# EAGLE design hovercraft (brian-pc's conflicted copy 2016-11-01) (EAGLE 6.6.0)
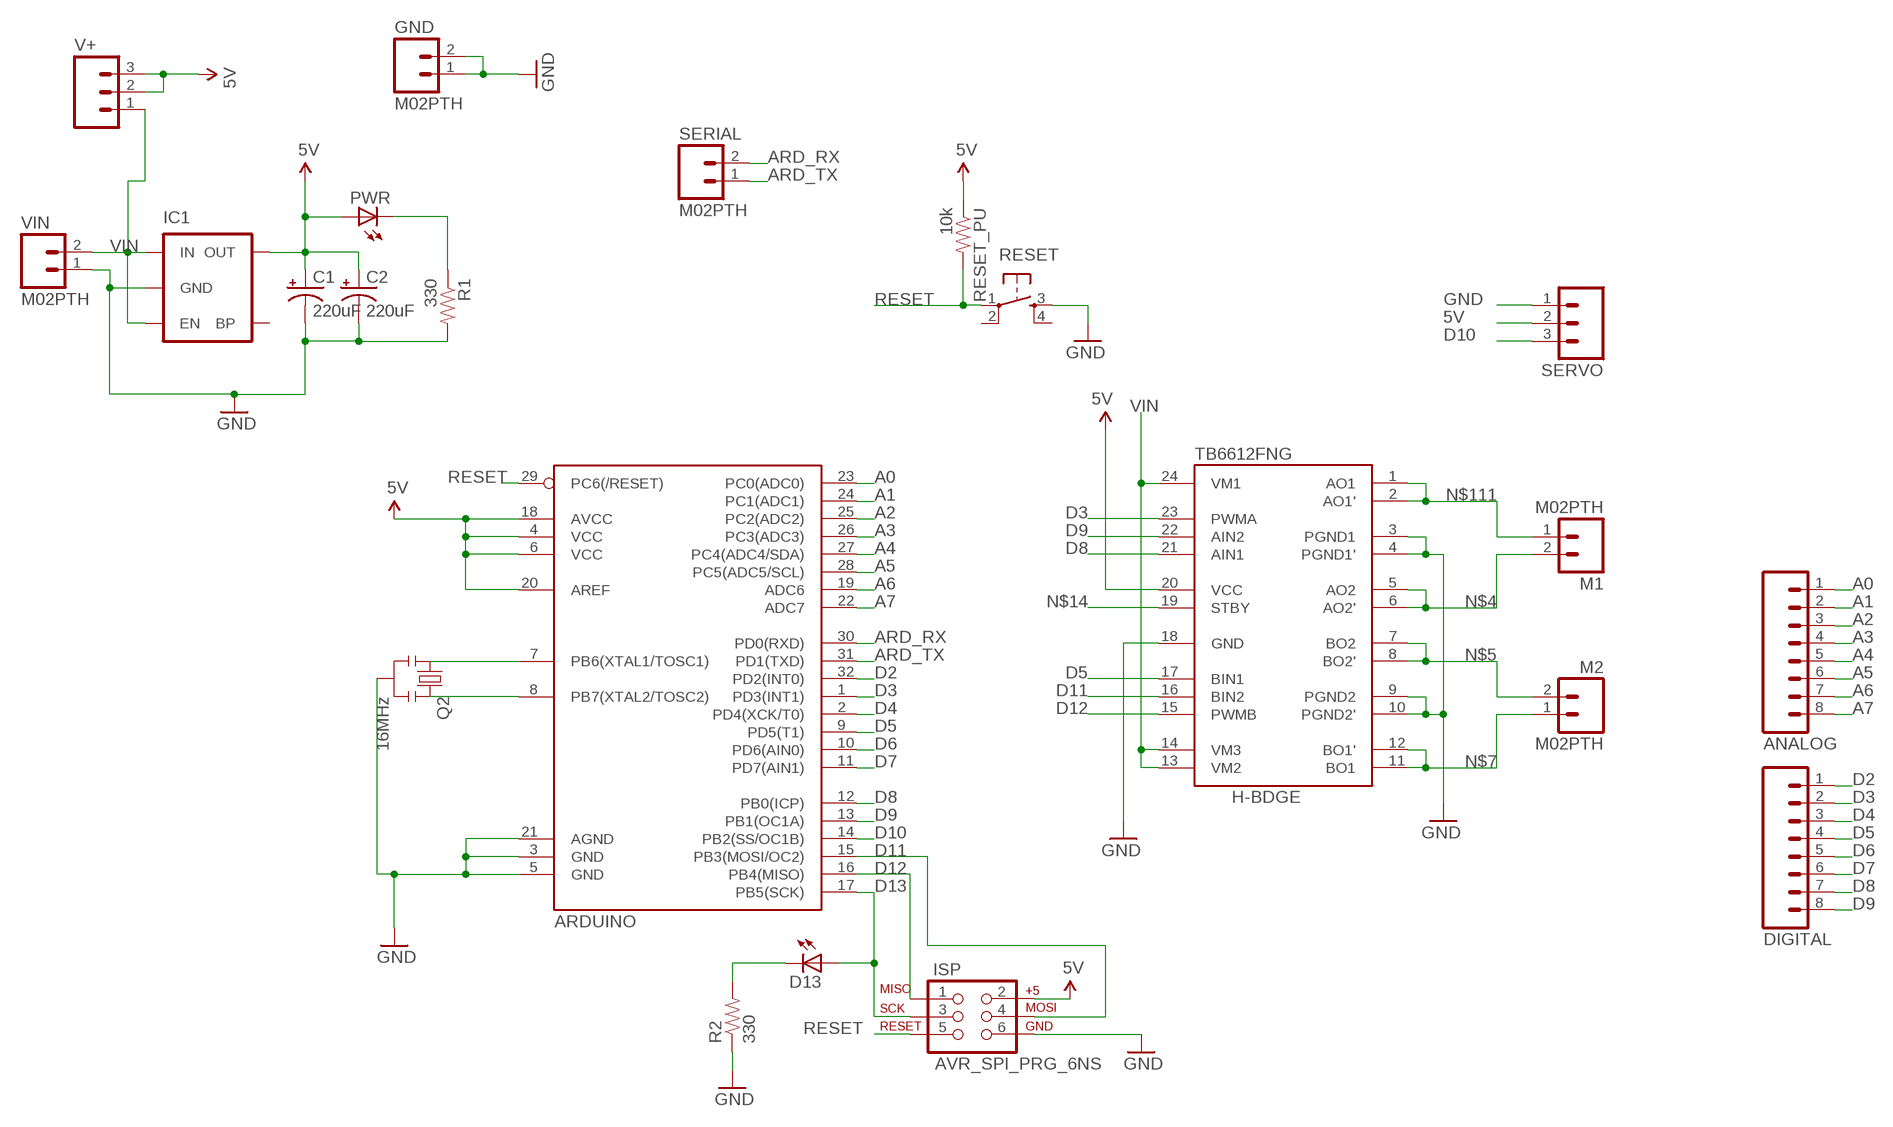
[diagram p0: schematic, sheet 1]

## Parts
ANALOG  M08LOCK  [1X08_LOCK]
ARDUINO  ATMEGA328_SMT  [TQFP32-08]
C1  220uF  CAP_POLPTH1  [CPOL-RADIAL-100UF-25V]
C2  220uF  CAP_POLPTH1  [CPOL-RADIAL-100UF-25V]
D13  LEDCHIPLED_0805  [CHIPLED_0805]
DIGITAL  M08LOCK  [1X08_LOCK]
GND  M02PTH  [1X02]
H-BDGE  TB6612FNG  [SSOP24]
IC1  MIC52055V  [SOT23-5]
ISP  AVR_SPI_PRG_6NS  [2X3-NS]
M1  M02PTH  [1X02]
M2  M02PTH  [1X02]
PWR  LEDCHIPLED_0805  [CHIPLED_0805]
Q2  16MHz  RESONATOR16MHZ  [RESONATOR-SMD]
R1  330  RESISTOR0805-RES  [0805]
R2  330  RESISTOR0805-RES  [0805]
RESET  TAC_SWITCHSMD  [TACTILE_SWITCH_SMD]
RESET_PU  10k  RESISTOR0805-RES  [0805]
SERIAL  M02PTH  [1X02]
SERVO  M03PTH  [1X03]
V+  M03PTH  [1X03]
VIN  M02PTH  [1X02]

## Nets
5V: ARDUINO.4(VCC) ARDUINO.6(VCC) ARDUINO.18(AVCC) ARDUINO.20(AREF) C1.1(+) C2.1(+) H-BDGE.20(VCC) IC1.5(OUT) ISP.2 PWR.A RESET_PU.1 SERVO.2 V+.2 V+.3
A0: ANALOG.1 ARDUINO.23(PC0(ADC0))
A1: ANALOG.2 ARDUINO.24(PC1(ADC1))
A2: ANALOG.3 ARDUINO.25(PC2(ADC2))
A3: ANALOG.4 ARDUINO.26(PC3(ADC3))
A4: ANALOG.5 ARDUINO.27(PC4(ADC4/SDA))
A5: ANALOG.6 ARDUINO.28(PC5(ADC5/SCL))
A6: ANALOG.7 ARDUINO.19(ADC6)
A7: ANALOG.8 ARDUINO.22(ADC7)
ARD_RX: ARDUINO.30(PD0(RXD)) SERIAL.2
ARD_TX: ARDUINO.31(PD1(TXD)) SERIAL.1
D2: ARDUINO.32(PD2(INT0)) DIGITAL.1
D3: ARDUINO.1(PD3(INT1)) DIGITAL.2 H-BDGE.23(PWMA)
D4: ARDUINO.2(PD4(XCK/T0)) DIGITAL.3
D5: ARDUINO.9(PD5(T1)) DIGITAL.4 H-BDGE.17(BIN1)
D6: ARDUINO.10(PD6(AIN0)) DIGITAL.5
D7: ARDUINO.11(PD7(AIN1)) DIGITAL.6
D8: ARDUINO.12(PB0(ICP)) DIGITAL.7 H-BDGE.21(AIN1)
D9: ARDUINO.13(PB1(OC1A)) DIGITAL.8 H-BDGE.22(AIN2)
D10: ARDUINO.14(PB2(SS/OC1B)) SERVO.3
D11: ARDUINO.15(PB3(MOSI/OC2)) H-BDGE.16(BIN2) ISP.4
D12: ARDUINO.16(PB4(MISO)) H-BDGE.15(PWMB) ISP.1
D13: ARDUINO.17(PB5(SCK)) D13.A ISP.3
GND: ARDUINO.3(GND) ARDUINO.5(GND) ARDUINO.21(AGND) C1.2(-) C2.2(-) GND.1 GND.2 H-BDGE.3(PGND1) H-BDGE.4(PGND1') H-BDGE.9(PGND2) H-BDGE.10(PGND2') H-BDGE.18(GND) IC1.2(GND) ISP.6 Q2.2 R1.2 R2.1 RESET.3 SERVO.1 VIN.1
N$1: PWR.C R1.1
N$3: D13.C R2.2
N$4: H-BDGE.5(AO2) H-BDGE.6(AO2') M1.2
N$5: H-BDGE.7(BO2) H-BDGE.8(BO2') M2.2
N$7: H-BDGE.11(BO1) H-BDGE.12(BO1') M2.1
N$9: ARDUINO.7(PB6(XTAL1/TOSC1)) Q2.1
N$10: ARDUINO.8(PB7(XTAL2/TOSC2)) Q2.3
N$14: H-BDGE.19(STBY)
N$111: H-BDGE.1(AO1) H-BDGE.2(AO1') M1.1
RESET: ARDUINO.29(PC6(/RESET)) ISP.5 RESET.1 RESET_PU.2
VIN: H-BDGE.13(VM2) H-BDGE.14(VM3) H-BDGE.24(VM1) IC1.1(IN) IC1.3(EN) V+.1 VIN.2
Unconnected: IC1.4(BP) RESET.2 RESET.4

## Library data of the parts
ANALOG DIGITAL = SparkFun-Connectors:M08: Header 8 Standard 8-pin 0.1" header. Use with straight break away headers (SKU : PRT-00116), right angle break away headers (PRT-00553), swiss pins (PRT-00743), machine pins (PRT-00117), and female headers (PRT-00115).
ARDUINO = SparkFun-DigitalIC:ATMEGA328_SMT: 32-Pin Atmega328 part Commonly used on Arduino compatible boards Available in QFP and QFN packages TQFP is IC-09069 QFN is non-stock; PROD_ID: IC-09069; VALUE: ATMEGA328P
C1 C2 = SparkFun-Capacitors:CAP_POL: Capacitor Polarized These are standard SMD and PTH capacitors. Normally 10uF, 47uF, and 100uF in electrolytic and tantalum varieties. Always verify the external diameter of the through hole cap, it varies with capacity, voltage, and manufacturer. The EIA devices should be standard.
D13 PWR = led:LED: LED OSRAM: - CHIPLED LG R971, LG N971, LY N971, LG Q971, LY Q971, LO R971, LY R971 LH N974, LH R974 LS Q976, LO Q976, LY Q976 LO Q996 - Hyper CHIPLED LW Q18S LB Q993, LB Q99A, LB R99A - SideLED LS A670, LO A670, LY A670, LG A670, LP A670 LB A673, LV A673, LT A673, LW A673 LH A674 LY A675 LS A676, LA A676, LO A676, LY A676, LW A676 LS A679, LY A679, LG A679 - Hyper Micro SIDELED® LS Y876, LA Y876, LO Y876, LY Y876 LT Y87S - SmartLED LW L88C, LW L88S LB L89C, LB L89S, LG L890 LS L89K, LO L89K, LY L89K LS L896, LA L896, LO L896, LY L896 - TOPLED LS T670, LO T670, LY T670, LG T670, LP T670 LSG T670, LSP T670, LSY T670, LOP T670, LYG T670 LG T671, LOG T671, LSG T671 LB T673, LV T673, LT T673, LW T673 LH T674 LS T676, LA T676, LO T676, LY T676, LB T676, LH T676, LSB T676, LW T676 LB T67C, LV T67C, LT T67C, LS T67K, LO T67K, LY T67K, LW E67C LS E67B, LA E67B, LO E67B, LY E67B, LB E67C, LV E67C, LT E67C LW T67C LS T679, LY T679, LG T679 LS T770, LO T770, LY T770, LG T770, LP T770 LB T773, LV T773, LT T773, LW T773 LH T774 LS E675, LA E675, LY E675, LS T675 LS T776, LA T776, LO T776, LY T776, LB T776 LHGB T686 LT T68C, LB T68C - Hyper Mini TOPLED® LB M676 - Mini TOPLED Santana® LG M470 LS M47K, LO M47K, LY M47K Source: http://www.osram.convergy.de LUXEON: - LUMILED® LXK2-PW12-R00, LXK2-PW12-S00, LXK2-PW14-U00, LXK2-PW14-V00 LXK2-PM12-R00, LXK2-PM12-S00, LXK2-PM14-U00 LXK2-PE12-Q00, LXK2-PE12-R00, LXK2-PE12-S00, LXK2-PE14-T00, LXK2-PE14-U00 LXK2-PB12-K00, LXK2-PB12-L00, LXK2-PB12-M00, LXK2-PB14-N00, LXK2-PB14-P00, LXK2-PB14-Q00 LXK2-PR12-L00, LXK2-PR12-M00, LXK2-PR14-Q00, LXK2-PR14-R00 LXK2-PD12-Q00, LXK2-PD12-R00, LXK2-PD12-S00 LXK2-PH12-R00, LXK2-PH12-S00 LXK2-PL12-P00, LXK2-PL12-Q00, LXK2-PL12-R00 Source: www.luxeon.com KINGBRIGHT: KA-3528ASYC Source: www.kingbright.com
GND M1 M2 SERIAL VIN = SparkFun-Connectors:M02: Standard 2-pin 0.1" header. Use with - straight break away headers ( PRT-00116) - right angle break away headers (PRT-00553) - swiss pins (PRT-00743) - machine pins (PRT-00117) - female headers (PRT-00115) Molex polarized connector foot print use with: PRT-08233 with associated crimp pins and housings. 2.54_SCREWTERM for use with PRT-10571. 3.5mm Screw Terminal footprints for PRT-08084 5mm Screw Terminal footprints for use with PRT-08433
H-BDGE = adafruit:TB6612FNG: TB6612FNG MOS dual H-bridge motor driver, 1.2A current 3.2A peak 3 or 5v logic and 3-15v motor
IC1 = SparkFun-PowerIC:MIC5205: MIC5205 150mA vreg 3.3V - VREG-00822 5V - VREG-00823; PROD_ID: VREG-00823
ISP = SparkFun-Connectors:AVR_SPI_PRG_6: AVR ISP 6 Pin This is the reduced ISP connector for AVR programming. Common on Arduino. This footprint will take up less PCB space and can be used with a 10-pin to 6-pin adapter such as SKU: BOB-08508
Q2 = SparkFun-FreqCtrl:RESONATOR: Resonator Small SMD resonator. Used, eg, on the Arduino Pro/ Pro Mini boards. 8MHz- XTAL-08895 16MHz- XTAL-08900; PROD_ID: XTAL-08900
R1 R2 RESET_PU = SparkFun-Resistors:RESISTOR: Resistor Basic schematic elements and footprints for 0603, 1206, and PTH resistors.
RESET = SparkFun-Electromechanical:TAC_SWITCH: Momentary Switch Button commonly used for reset or general input. Spark Fun Electronics SKU : COM-00097 SMT- SWCH-08247; PROD_ID: SWCH-08247
SERVO V+ = SparkFun-Connectors:M03: Header 3 Standard 3-pin 0.1" header. Use with straight break away headers (SKU : PRT-00116), right angle break away headers (PRT-00553), swiss pins (PRT-00743), machine pins (PRT-00117), and female headers (PRT-00115). Molex polarized connector foot print use with SKU : PRT-08232 with associated crimp pins and housings.

## Net classes
0 default: clearance 0.205 mm

## Board
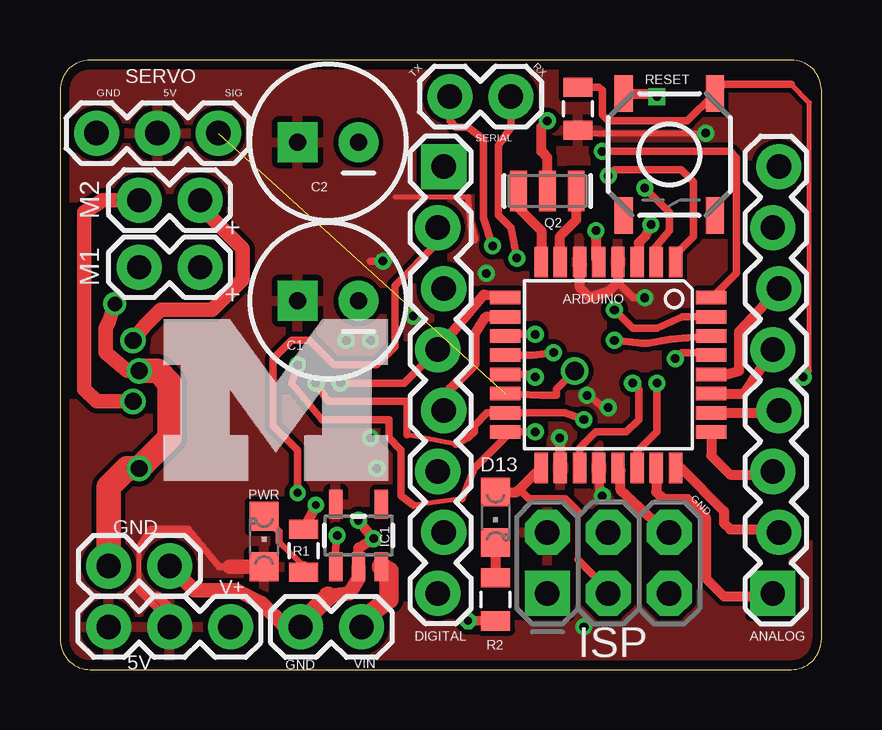
[diagram p1: board, top side]
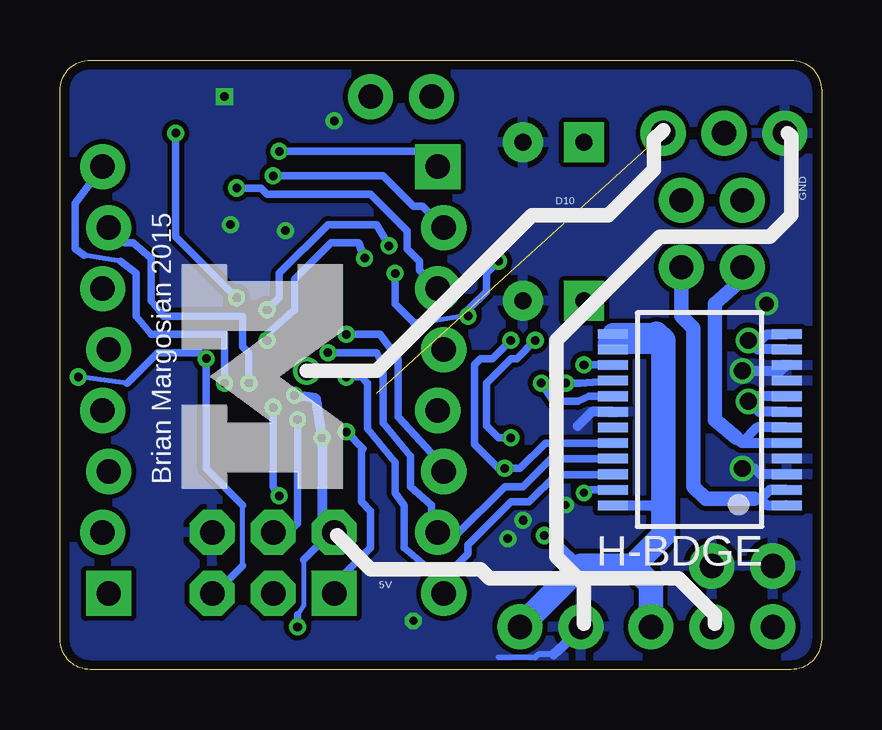
[diagram p2: board, bottom side, seen from below]

Size 31.75 x 25.4 mm. Coordinates in mm from the lower left corner, seen from the top.
Outline: 31.75,1.27 31.75,24.13 arc90 30.48,25.4 1.27,25.4 arc90 0,24.13 0,1.27 arc90 1.27,0 30.48,0 arc90 31.75,1.27
Copper layers (1*16): Top 0.0356mm / dielectric 1.5011mm / Bottom 0.0356mm
Design rules "OshPark2014": minimum track width 6mil, minimum drill 13mil, track to track 6mil, track to pad 6mil, pad to pad 6mil, via to via 6mil, smd to smd 6mil, copper to edge 15mil, drill to drill 6mil, minimum pad ring 7mil, minimum via ring 7mil, stop-mask expansion 3mil, vias tented up to drill 0mil, thermal gap 10mil

### Footprints (pad centres in the part's own frame; a part is rotated, then mirrored left to right if it is on the bottom)
1X08_LOCK = drill 1.016 pad 1.88 square: 1 0,0.127 | drill 1.016 pad 1.88: 2 2.54,-0.127; 3 5.08,0.127; 4 7.62,-0.127; 5 10.16,0.127; 6 12.7,-0.127; 7 15.24,0.127; 8 17.78,-0.127
TQFP32-08 = smd 1.27 x 0.559: 1 -4.293,2.8; 2 -4.293,2; 3 -4.293,1.2; 4 -4.293,0.4; 5 -4.293,-0.4; 6 -4.293,-1.2; 7 -4.293,-2; 8 -4.293,-2.8; 17 4.293,-2.8; 18 4.293,-2; 19 4.293,-1.2; 20 4.293,-0.4; 21 4.293,0.4; 22 4.293,1.2; 23 4.293,2; 24 4.293,2.8 | smd 0.559 x 1.27: 9 -2.8,-4.293; 10 -2,-4.293; 11 -1.2,-4.293; 12 -0.4,-4.293; 13 0.4,-4.293; 14 1.2,-4.293; 15 2,-4.293; 16 2.8,-4.293; 25 2.8,4.293; 26 2,4.293; 27 1.2,4.293; 28 0.4,4.293; 29 -0.4,4.293; 30 -1.2,4.293; 31 -2,4.293; 32 -2.8,4.293
CPOL-RADIAL-100UF-25V = drill 0.7 pad 1.651 square: 1 1.27,0 | drill 0.7 pad 1.651: 2 -1.27,0
CHIPLED_0805 = smd 1.2 x 1.2: A 0,-1.05; C 0,1.05
1X02 = drill 1.016 pad 1.88: 1 0,0; 2 2.54,0
SSOP24 = smd 0.4 x 1.25: 1 -3.575,-3.625; 2 -2.925,-3.625; 3 -2.275,-3.625; 4 -1.625,-3.625; 5 -0.975,-3.625; 6 -0.325,-3.625; 7 0.325,-3.625; 8 0.975,-3.625; 9 1.625,-3.625; 10 2.275,-3.625; 11 2.925,-3.625; 12 3.575,-3.625; 13 3.575,3.625; 14 2.925,3.625; 15 2.275,3.625; 16 1.625,3.625; 17 0.975,3.625; 18 0.325,3.625; 19 -0.325,3.625; 20 -0.975,3.625; 21 -1.625,3.625; 22 -2.275,3.625; 23 -2.925,3.625; 24 -3.575,3.625
SOT23-5 = smd 0.55 x 1.2: 1 -0.95,-1.3; 2 0,-1.3; 3 0.95,-1.3; 4 0.95,1.3; 5 -0.95,1.3
2X3-NS = drill 1.016 pad 1.88 square: 1 -2.54,-1.27 | drill 1.016 pad 1.88 octagon: 2 -2.54,1.27; 3 0,-1.27; 4 0,1.27; 5 2.54,-1.27; 6 2.54,1.27
RESONATOR-SMD = smd 0.7 x 1.7: 1 -1.2,0; 2 0,0; 3 1.2,0
0805 = smd 0.8 x 1.2: 1 -0.9,0; 2 0.9,0
TACTILE_SWITCH_SMD = smd 1.524 x 0.762: 1 -2.54,1.905; 2 2.54,1.905; 3 -2.54,-1.905; 4 2.54,-1.905
1X03 = drill 1.016 pad 1.88: 1 0,0; 2 2.54,0; 3 5.08,0

### Placement (x,y rotation side)
ANALOG  29.84,3.17 90 top
ARDUINO  22.86,12.7 270 top
C1  11.18,15.37 180 top
C2  11.18,21.97 180 top
D13  18.16,6.35 180 top
DIGITAL  15.88,20.95 270 top
GND  2.03,4.32 0 top
H-BDGE  5.08,10.41 90 bottom
IC1  12.45,5.59 0 top
ISP  22.86,4.45 0 top
M1  5.84,16.76 180 top
M2  5.84,19.56 180 top
PWR  8.51,5.33 0 top
Q2  20.32,19.94 180 top
R1  10.16,4.95 90 top
R2  18.16,2.92 90 top
RESET  25.4,21.46 270 top
RESET_PU  21.59,23.37 90 top
SERIAL  16.26,23.88 0 top
SERVO  1.52,22.35 0 top
U$1  [BLOCKM]  26.67,16.89 270 bottom
U$2  [BLOCKM]  4.32,7.87 0 top
V+  7.11,1.78 180 top
VIN  10.03,1.78 0 top

### Tracks (layer width: path | path; a pad name or v marks a point on that pad's centre or on a via)
5V  (via drill 0.36)
  Top 0.203: 17.02,19.68 13.97,19.68 | 3.3,3.3 3.3,5.08
  Top 0.254: 21.71,22.35 v26.92,22.35 | 17.14,18.54 17.02,19.68
  Top 0.305: v22.86,10.92 22.61,10.92 22.35,11.18 | RESET_PU.1 21.71,22.35 | v24.38,15.49 23.91,15.49 23.26,16.15 | v13.46,17.02 12.95,17.02 | 17.27,18.03 17.27,17.91 17.14,18.54 | V+.2 4.57,2.03 3.3,3.3 | 3.3,5.08 3.81,5.84 5.33,5.84 6.64,4.28 7.08,4.28 | ARDUINO.20 22.46,7.47 v22.61,7.24 22.35,8.41 ARDUINO.20
  Top 0.406: ARDUINO.18 20.86,9.62 v20.83,9.65 | ARDUINO.6 21.66,15.93 22.1,15.49 22.86,15.75 23.26,16.15 ARDUINO.4 | 4.57,2.03 4.57,2.54 4.06,3.05
  Top 0.61: PWR.A 7.08,4.28
  Bottom 0.203: 14.99,14.73 16.51,14.48 | 21.59,4.57 21.59,2.67 21.84,2.29
  Bottom 0.254: 16.51,14.48 17.02,14.48
  Bottom 0.305: v22.61,7.24 22.86,7.62 v22.86,10.92 | 14.99,14.73 v14.73,14.73 14.73,14.99 13.97,15.75 13.97,16.51 v13.46,17.02 | 17.02,14.48 17.78,15.24 v17.78,16.51 | v26.92,22.35 26.92,18.03 v24.38,15.49 | v21.84,1.78 21.84,2.29 | 21.59,4.57 20.32,5.84 ISP.2 | v12.95,13.72 13.72,12.95 14.22,12.95 14.48,12.7 14.48,9.4 13.46,8.38 v13.21,8.38 12.57,8.38 11.52,9.44 H-BDGE.20 | v12.95,9.65 13.46,9.65 13.97,10.16 13.97,11.94 12.95,12.95 12.7,12.95 v11.94,13.72
  Bottom 0.406: ISP.2 20.83,6.22 v20.83,9.65 21.08,11.3 v21.97,11.43
  pour Top (rank 2): 1.27,25.4 30.48,25.4 arc-90 31.75,24.13 31.75,1.27 arc-90 30.48,0 1.27,0 arc-90 0,1.27 0,24.13 arc-90
A0
  Top 0.406: ARDUINO.23 24.86,7.4 25.15,7.11 26.16,7.11 26.92,6.35 26.92,3.81 27.69,3.05 29.59,3.05 ANALOG.1
A1
  Top 0.406: ARDUINO.24 25.88,8.41 27.69,6.6 27.69,6.1 27.94,5.84 29.84,5.84 ANALOG.2
A2
  Top 0.406: ARDUINO.25 27.15,8.91 27.94,8.13 29.59,8.13 ANALOG.3
A3
  Top 0.406: ARDUINO.26 29.88,10.7 ANALOG.4
A4
  Top 0.406: ARDUINO.27 28.52,11.5 ANALOG.5
A5
  Top 0.406: ARDUINO.28 27.79,12.3 28.32,12.45 28.32,14.1 ANALOG.6
A6  (via drill 0.36)
  Top 0.305: ARDUINO.19 21.66,9.21 22.35,9.91 23.62,9.91 24.13,10.41 24.13,11.68 v23.88,11.94
  Bottom 0.305: ANALOG.7 29.08,17.78 28.7,17.78 27.94,17.14 27.94,15.37 27.43,14.73 24.13,14.73 24.13,13.46 23.88,13.21 v23.88,11.94
A7  (via drill 0.36)
  Top 0.305: ARDUINO.22 24.06,9.07 24.89,9.91 v24.89,11.94
  Bottom 0.203: 29.21,17.02 30.73,17.27
  Bottom 0.305: 29.21,17.02 28.57,16.51 28.57,14.73 27.94,13.97 24.89,13.97 v24.89,11.94 | 30.73,17.27 31.11,17.53 31.11,19.43 ANALOG.8
ARD_RX  (via drill 0.36)
  Top 0.305: ARDUINO.30 25.46,13.77 24.51,13.59 24.26,13.59 v23.11,13.72 | v19.05,17.14 18.8,18.41 18.29,18.92 18.29,21.84 18.8,22.61 SERIAL.2
  Bottom 0.305: v23.11,13.72 23.11,13.97 21.97,14.99 21.97,16.26 20.45,17.78 19.3,17.78 v19.05,17.14
ARD_TX  (via drill 0.36)
  Top 0.305: ARDUINO.31 25.94,14.7 24.89,14.22 23.88,14.22 v23.11,14.99 | SERIAL.1 16.26,22.86 16.51,22.61 17.02,22.61 17.65,22.1 17.65,18.8 v18.03,17.65
  Bottom 0.305: v23.11,14.99 22.61,15.49 22.61,16.51 20.57,18.54 18.54,18.54 v18.03,17.65
D2  (via drill 0.36)
  Top 0.305: ARDUINO.32 27.18,15.5 28.19,16.51 28.19,21.34 27.94,21.59 v22.61,21.59
  Bottom 0.305: v22.61,21.59 16.64,21.59 DIGITAL.1
D3  (via drill 0.33, 0.36)
  Top 0.305: ARDUINO.1 25.66,17.28 26.42,18.03 26.42,20.32 25.91,20.83 23.11,20.83 v22.86,20.57 | v9.91,7.37 9.91,9.14 8.89,10.16 8.89,12.95 9.65,13.72 10.41,13.72 11.43,12.7 13.21,12.7 13.97,13.46 13.97,16 15.75,17.78 DIGITAL.2
  Bottom 0.305: v22.86,20.57 18.29,20.57 17.02,19.3 16.64,19.3 DIGITAL.2 | H-BDGE.23 9.78,7.49 v9.91,7.37
D4  (via drill 0.36)
  Top 0.305: ARDUINO.2 24.73,17.49 25.4,18.29 25.4,19.05 v24.38,20.07
  Bottom 0.305: v24.38,20.07 23.37,20.07 23.11,19.81 18.8,19.81 17.27,18.29 17.27,17.53 16.76,17.02 16.76,16.64 DIGITAL.3
D5  (via drill 0.36)
  Top 0.305: v11.68,11.94 14.35,11.94 DIGITAL.4
  Top 0.406: ARDUINO.9 17.66,15.63 DIGITAL.4
  Bottom 0.305: H-BDGE.17 9.69,11.39 10.16,11.18 11.18,11.18 v11.68,11.94
D6
  Top 0.406: ARDUINO.10 17.75,14.7 17.27,13.97 17.27,12.7 16.26,11.68 16.26,11.05 DIGITAL.5
D7  (via drill 0.36)
  Top 0.305: v19.81,13.97 18.64,13.97 ARDUINO.11
  Bottom 0.305: v19.81,13.97 18.41,13.97 17.65,12.95 17.65,10.54 16.26,9.02 16.26,8.76 DIGITAL.6
D8  (via drill 0.36)
  Top 0.305: ARDUINO.12 19.7,13.1 v20.57,13.21
  Bottom 0.305: v20.57,13.21 18.54,13.21 18.29,12.7 18.29,10.29 17.14,8.89 17.14,7.62 16.26,6.86 16.26,5.97 DIGITAL.7 15.88,5.59 15.24,5.59 13.21,7.62 12.45,7.62 11.28,8.79 H-BDGE.21
D9  (via drill 0.36)
  Top 0.305: ARDUINO.13 19.7,12.3 v19.81,12.19
  Bottom 0.305: v19.81,12.19 19.18,12.19 18.92,11.94 18.92,10.03 17.78,8.64 17.78,7.37 17.4,6.86 17.4,5.08 16.51,4.32 16.26,4.32 15.75,3.81 | 15.75,3.81 DIGITAL.8 | H-BDGE.22 8.72,8.13 11.05,8.13 12.19,6.99 12.95,6.99 14.73,5.21 14.73,4.83 15.75,3.81
D10  (via drill 0.76)  (1 unrouted)
  Top 0.305: ARDUINO.14 20.07,11.43 20.7,11.43 20.7,11.68 v21.46,12.45
D11  (via drill 0.36)
  Top 0.203: 16.51,9.4 14.48,9.78
  Top 0.305: v21.84,10.41 21.05,10.7 ARDUINO.15 17.81,10.7 17.27,10.16 17.27,9.91 17.02,9.65 16.51,9.4 | 14.48,9.78 14.48,11.18 11.18,11.18 v10.67,11.94
  Bottom 0.305: v21.84,10.41 21.84,6.1 22.1,5.84 22.73,5.84 ISP.4 | v10.67,11.94 10.08,11.94 H-BDGE.16
D12  (via drill 0.36)
  Top 0.203: 16.76,7.11 14.73,6.86
  Top 0.305: v19.81,9.91 ARDUINO.16 18.57,9.68 17.27,8.38 16.76,7.11 | 14.73,6.86 14.22,7.24 14.22,9.14 13.72,9.65 13.72,10.41 10.92,10.41 9.65,11.94 v9.91,12.7
  Bottom 0.305: v19.81,9.9 v19.81,9.91 19.11,9.21 19.18,9.14 19.18,6.99 18.8,6.6 18.8,5.08 20.32,3.56 ISP.1 | v9.91,12.7 H-BDGE.15
D13
  Top 0.203: 21.59,4.57 21.59,6.6
  Top 0.305: ISP.3 22.86,3.3 21.59,4.57 | 21.59,6.6 21.08,7.11 19.56,7.11 19.16,7.51
  Top 0.406: D13.A 19.05,7.4 19.16,7.51 ARDUINO.17
GND  (via drill 0.33, 0.36, 0.6, 0.7)
  Top 0.305: 12.45,4.57 IC1.2
  Top 0.406: v10.67,6.86 R1.2 | Q2.2 20.32,21.34 20.07,21.59 20.07,22.61 v20.32,22.86 | RESET.3 24.77,24 v24.89,23.88 | v22.35,18.29 22.35,17.1 ARDUINO.5 | R2.1 v17.02,2.03 | ISP.6 25.27,5.71 23.37,7.49 23.37,8.3 ARDUINO.21 | 9.91,1.78 VIN.1 | v24.64,18.54 24.38,18.03 24.13,17.78 24.13,17.06 ARDUINO.3 | v12.45,6.22 v13.08,5.46 12.45,5.08 12.45,4.57
  Top 0.61: 11.18,3.05 12.06,3.17 12.45,3.81 IC1.2 | GND.2 5.59,3.3 7.37,3.3 8.38,2.79 9.4,1.78 9.91,1.78 | v2.29,15.24 2.03,14.48 1.91,14.22 1.91,13.21 2.79,12.45 v3.3,12.45
  Top 0.813: VIN.1 10.03,1.91 11.18,3.05
  Top 1.016: GND.1 2.03,7.62 2.79,8.38 v3.3,8.38 4.57,9.65 4.57,11.94 4.06,12.45 v3.3,12.45
  Bottom 0.229: 11.94,0.51 13.46,0.51
  Bottom 0.254: 11.18,0.64 11.81,0.64 11.94,0.51
  Bottom 0.406: v3.3,12.45 1.7,12.45 H-BDGE.10 | H-BDGE.3 2.55,8.14 2.79,8.38 | H-BDGE.18 9.58,10.74 10.16,10.16 | 9.91,1.78 11.18,0.64
  pour Bottom: 1.27,25.4 30.48,25.4 arc-90 31.75,24.13 31.75,1.27 arc-90 30.48,0 1.27,0 arc-90 0,1.27 0,24.13 arc-90
N$1
  Top 0.254: 10.16,4.32 9.14,5.33
  Top 0.305: 9.14,5.33 9.14,5.75 PWR.C
  Top 0.406: R1.1 10.16,4.32
N$3
  Top 0.406: D13.C R2.2
N$4
  Bottom 0.406: H-BDGE.5 3.34,9.44 | 3.34,9.44 3.56,9.65 | H-BDGE.6 2.69,10.09 3.34,9.44
  Bottom 0.61: M1.2 3.3,16.26 4.45,15.24 4.45,10.41 3.56,9.65
N$5  (via drill 0.7)
  Top 0.61: M2.2 1.78,19.56 1.02,19.05 1.02,11.68 1.52,11.18 v3.05,11.18
  Bottom 0.406: H-BDGE.8 2.83,11.39 v3.05,11.18 2.61,10.74 H-BDGE.7
N$7  (via drill 0.7)
  Top 0.61: M2.1 5.84,19.3 7.62,17.53 7.62,16.26 6.35,14.99 4.19,14.99 3.56,14.35 v3.05,13.72
  Bottom 0.406: H-BDGE.12 1.47,13.97 2.29,13.97 2.54,13.72 v3.05,13.72 2.67,13.34 H-BDGE.11
N$9
  Top 0.406: Q2.1 21.52,18.73 20.83,18.03 20.83,17.02 ARDUINO.7
N$10
  Top 0.406: Q2.3 19.12,19.23 20.07,18.29 ARDUINO.8
N$111
  Bottom 0.406: 2.79,7.11 2.54,7.11 | 2.54,7.11 2.29,6.86 1.47,6.86 H-BDGE.1 | H-BDGE.2 2.16,7.49 2.54,7.11
  Bottom 0.61: M1.1 5.84,14.73 5.33,14.22 5.33,7.62 4.83,7.11 2.79,7.11
RESET  (via drill 0.36)
  Top 0.203: v30.99,12.19 31.24,12.45 31.24,23.62 30.48,24.38
  Top 0.305: RESET_PU.2 22.47,24.27 22.61,24.13 22.61,23.11 22.86,22.86 26.16,22.86 RESET.1 27.69,24.38 30.48,24.38 | ARDUINO.29 27.05,13.21 25.91,13.21 v25.65,12.95
  Bottom 0.203: 24.13,4.32 24.13,6.86 | 28.96,11.94 v30.99,12.19
  Bottom 0.305: ISP.5 25.27,3.17 24.13,4.32 | 24.13,6.86 25.65,8.38 v25.65,12.95 25.91,13.21 27.69,13.21 28.96,11.94
VIN  (via drill 0.36)
  Top 0.305: IC1.1 11.5,5.01 v11.56,5.59
  Top 0.813: VIN.2 12.7,2.16 13.72,2.92 13.72,4.09 IC1.3
  Bottom 0.305: v11.56,5.59 11.05,5.33 10.03,4.32 | 8.89,13.59 H-BDGE.14
  Bottom 0.406: H-BDGE.24 7.09,6.84 6.6,6.35
  Bottom 0.61: 6.6,13.72 6.73,13.72 6.99,13.59
  Bottom 0.889: H-BDGE.13 6.88,13.99 | 8.89,13.59 6.99,13.59
  Bottom 1.016: 6.88,13.99 6.6,13.72 6.6,6.35 6.6,5.59 7.87,4.32 | 7.87,4.32 10.03,4.32 VIN.2 | V+.1 7.11,3.56 7.87,4.32

### Text on the board
tPlace: TX | RX
bPlace: GND | D10 | 5V
tNames: GND | 5V | SIG | + | + | GND | 5V | GND
bNames: Brian Margosian 2015